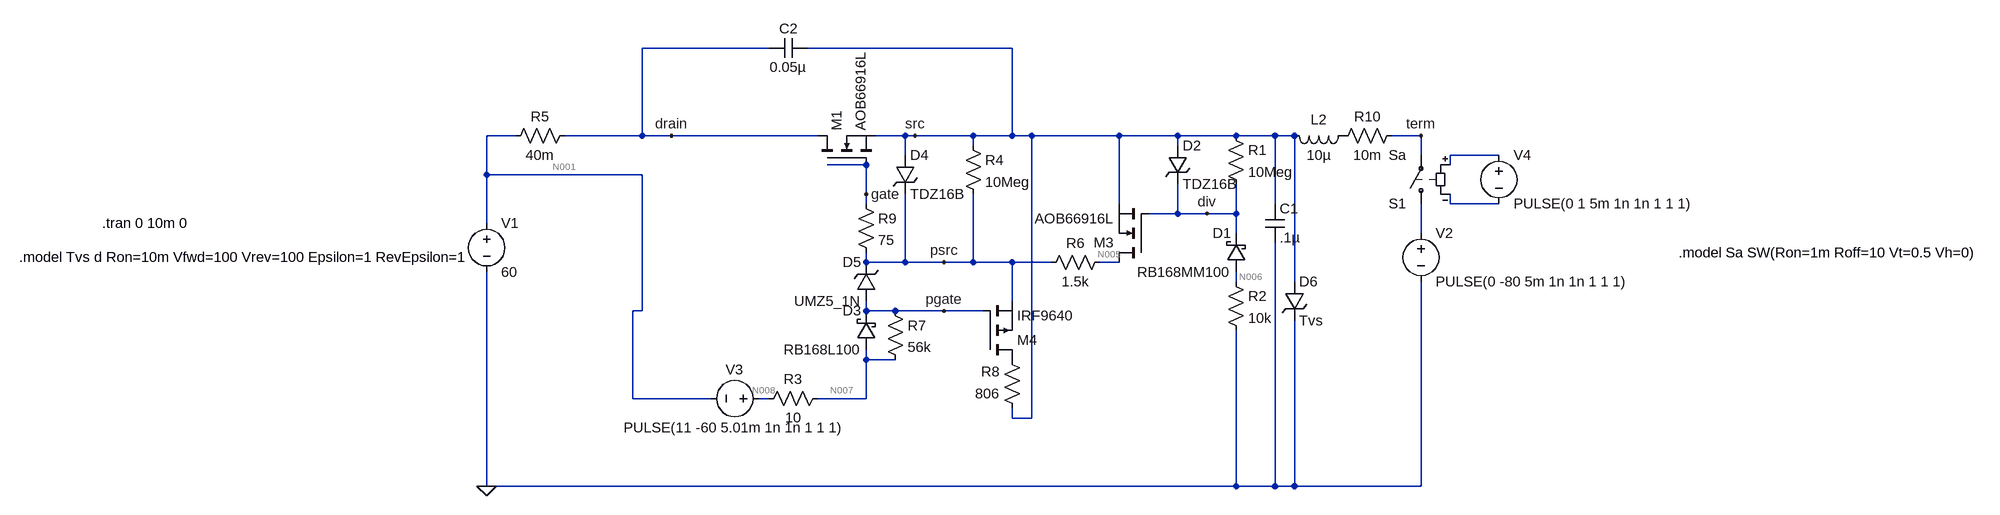
[diagram p0: schematic FET Driver rev3.asc]
FET Driver rev3.asc, the LTspice schematic file:
Version 4
SHEET 1 1884 732
WIRE 0 -112 -208 -112
WIRE 400 -112 64 -112
WIRE -416 32 -464 32
WIRE -208 32 -208 -112
WIRE -208 32 -336 32
WIRE -160 32 -208 32
WIRE 80 32 -160 32
WIRE 224 32 176 32
WIRE 240 32 224 32
WIRE 336 32 240 32
WIRE 400 32 400 -112
WIRE 400 32 336 32
WIRE 432 32 400 32
WIRE 576 32 432 32
WIRE 672 32 576 32
WIRE 768 32 672 32
WIRE 832 32 768 32
WIRE 864 32 832 32
WIRE 1072 32 1024 32
WIRE 336 48 336 32
WIRE 672 48 672 32
WIRE 224 64 224 32
WIRE 1072 64 1072 32
WIRE 1200 64 1120 64
WIRE 160 80 96 80
WIRE 1120 80 1120 64
WIRE -464 96 -464 32
WIRE -208 96 -464 96
WIRE 160 128 160 80
WIRE 160 144 160 128
WIRE 576 144 576 32
WIRE 832 144 832 32
WIRE 1120 144 1120 128
WIRE 1200 144 1120 144
WIRE 672 160 672 112
WIRE 672 160 624 160
WIRE 720 160 672 160
WIRE 768 160 768 112
WIRE 768 160 720 160
WIRE -464 176 -464 96
WIRE 768 192 768 160
WIRE 1072 192 1072 144
WIRE 160 240 160 224
WIRE 224 240 224 128
WIRE 224 240 160 240
WIRE 288 240 224 240
WIRE 336 240 336 128
WIRE 336 240 288 240
WIRE 400 240 336 240
WIRE 464 240 400 240
WIRE 576 240 544 240
WIRE 768 272 768 256
WIRE 864 272 864 32
WIRE 400 304 400 240
WIRE -208 320 -208 96
WIRE -208 320 -224 320
WIRE 160 320 160 304
WIRE 208 320 160 320
WIRE 288 320 208 320
WIRE 352 320 288 320
WIRE 160 400 160 384
WIRE 208 400 160 400
WIRE -224 464 -224 320
WIRE -96 464 -224 464
WIRE 0 464 -16 464
WIRE 160 464 160 400
WIRE 160 464 80 464
WIRE 400 496 400 480
WIRE 432 496 432 32
WIRE 432 496 400 496
WIRE -464 608 -464 256
WIRE 768 608 768 352
WIRE 768 608 -464 608
WIRE 832 608 832 208
WIRE 832 608 768 608
WIRE 864 608 864 336
WIRE 864 608 832 608
WIRE 1072 608 1072 272
WIRE 1072 608 864 608
FLAG 720 160 div
FLAG 240 32 src
FLAG 160 128 gate
FLAG 1072 32 term
FLAG -464 608 0
FLAG 288 320 pgate
FLAG 288 240 psrc
FLAG -160 32 drain
SYMBOL nmos 80 80 R270
SYMATTR InstName M1
SYMATTR Value AOB66916L
SYMBOL voltage -464 160 R0
WINDOW 123 0 0 Left 0
WINDOW 39 0 0 Left 0
SYMATTR InstName V1
SYMATTR Value 60
SYMBOL voltage 1072 176 R0
WINDOW 123 0 0 Left 0
WINDOW 39 0 0 Left 0
SYMATTR InstName V2
SYMATTR Value PULSE(0 -80 5m 1n 1n 1 1 1)
SYMBOL res 752 16 R0
SYMATTR InstName R1
SYMATTR Value 10Meg
SYMBOL schottky 784 256 R180
WINDOW 0 24 64 Left 2
WINDOW 3 24 0 Left 2
SYMATTR InstName D1
SYMATTR Value RB168MM100
SYMATTR Description Diode
SYMATTR Type diode
SYMBOL res 752 256 R0
SYMATTR InstName R2
SYMATTR Value 10k
SYMBOL zener 656 48 R0
SYMATTR InstName D2
SYMATTR Value TDZ16B
SYMATTR Description Diode
SYMATTR Type diode
SYMBOL sw 1072 160 R180
SYMATTR InstName S1
SYMATTR Value Sa
SYMBOL voltage 1200 48 R0
WINDOW 123 0 0 Left 0
WINDOW 39 0 0 Left 0
SYMATTR InstName V4
SYMATTR Value PULSE(0 1 5m 1n 1n 1 1 1)
SYMBOL nmos 624 240 R180
SYMATTR InstName M3
SYMATTR Value AOB66916L
SYMBOL zener 208 64 R0
SYMATTR InstName D4
SYMATTR Value TDZ16B
SYMATTR Description Diode
SYMATTR Type diode
SYMBOL ind 960 16 R90
WINDOW 0 5 56 VBottom 2
WINDOW 3 32 56 VTop 2
SYMATTR InstName L2
SYMATTR Value 10µ
SYMBOL voltage 0 464 R90
WINDOW 0 -32 56 VBottom 2
WINDOW 3 32 56 VTop 2
WINDOW 123 0 0 Left 0
WINDOW 39 0 0 Left 0
SYMATTR InstName V3
SYMATTR Value PULSE(11 -60 5.01m 1n 1n 1 1 1)
SYMBOL res -320 16 R90
WINDOW 0 0 56 VBottom 2
WINDOW 3 32 56 VTop 2
SYMATTR InstName R5
SYMATTR Value 40m
SYMBOL res 560 224 R90
WINDOW 0 0 56 VBottom 2
WINDOW 3 32 56 VTop 2
SYMATTR InstName R6
SYMATTR Value 1.5k
SYMBOL res 320 32 R0
SYMATTR InstName R4
SYMATTR Value 10Meg
SYMBOL schottky 176 384 R180
WINDOW 0 24 64 Left 2
WINDOW 3 24 0 Left 2
SYMATTR InstName D3
SYMATTR Value RB168L100
SYMATTR Description Diode
SYMATTR Type diode
SYMBOL res 96 448 R90
WINDOW 0 0 56 VBottom 2
WINDOW 3 32 56 VTop 2
SYMATTR InstName R3
SYMATTR Value 10
SYMBOL zener 176 304 R180
WINDOW 0 24 64 Left 2
WINDOW 3 24 0 Left 2
SYMATTR InstName D5
SYMATTR Value UMZ5_1N
SYMATTR Description Diode
SYMATTR Type diode
SYMBOL pmos 352 400 M180
SYMATTR InstName M4
SYMATTR Value IRF9640
SYMBOL res 192 304 R0
SYMATTR InstName R7
SYMATTR Value 56k
SYMBOL res 416 496 R180
WINDOW 0 36 76 Left 2
WINDOW 3 36 40 Left 2
SYMATTR InstName R8
SYMATTR Value 806
SYMBOL TVSdiode 848 272 R0
SYMATTR InstName D6
SYMATTR Value Tvs
SYMBOL cap 816 144 R0
SYMATTR InstName C1
SYMATTR Value .1µ
SYMBOL cap 64 -128 R90
WINDOW 0 0 32 VBottom 2
WINDOW 3 32 32 VTop 2
SYMATTR InstName C2
SYMATTR Value 0.05µ
SYMBOL res 144 128 R0
SYMATTR InstName R9
SYMATTR Value 75
SYMBOL res 1040 16 R90
WINDOW 0 0 56 VBottom 2
WINDOW 3 32 56 VTop 2
SYMATTR InstName R10
SYMATTR Value 10m
TEXT -1096 176 Left 2 !.tran 0 10m 0
TEXT 1496 224 Left 2 !.model Sa SW(Ron=1m Roff=10 Vt=0.5 Vh=0)
TEXT -1232 232 Left 2 !.model Tvs d Ron=10m Vfwd=100 Vrev=100 Epsilon=1 RevEpsilon=1

The netlist it stands for:
* FET Driver rev3.asc
M1 drain gate src src AOB66916L
V1 N001 0 60
V2 N004 0 PULSE(0 -80 5m 1n 1n 1 1 1)
R1 src div 10Meg
D1 N006 div RB168MM100
R2 N006 0 10k
D2 src div TDZ16B
S1 N004 term N002 N003 Sa
V4 N002 N003 PULSE(0 1 5m 1n 1n 1 1 1)
M3 N005 div src src AOB66916L
D4 src psrc TDZ16B
L2 P001 src 10µ
V3 N008 N001 PULSE(11 -60 5.01m 1n 1n 1 1 1)
R5 drain N001 40m
R6 N005 psrc 1.5k
R4 src psrc 10Meg
D3 N007 pgate RB168L100
R3 N007 N008 10
D5 pgate psrc UMZ5_1N
M4 P002 pgate psrc psrc IRF9640
R7 pgate N007 56k
R8 src P002 806
D6 src 0 Tvs
C1 src 0 .1µ
C2 src drain 0.05µ
R9 gate psrc 75
R10 term P001 10m
.model D D
.lib standard.dio
.model NMOS NMOS
.model PMOS PMOS
.lib standard.mos
.tran 0 10m 0
.model Sa SW(Ron=1m Roff=10 Vt=0.5 Vh=0)
.model Tvs d Ron=10m Vfwd=100 Vrev=100 Epsilon=1 RevEpsilon=1
.backanno
.end

* Results of the author's LTspice run, read from the files saved beside the schematic
* Operating Point, zero values left out:
*   V(drain) = 59.76 V
*   V(gate) = 70.43 V
*   V(src) = 59.74 V
*   V(n001) = 60 V
*   V(div) = 59.48 V
*   V(n006) = 318.9 µV
*   V(term) = 59.68 V
*   V(n005) = 70.43 V
*   V(psrc) = 70.43 V
*   V(p001) = 59.74 V
*   V(n008) = 71 V
*   V(n007) = 71 V
*   V(pgate) = 70.94 V
*   V(p002) = 59.74 V
*   Id(M4) = -48.65 pA
*   Is(M4) = 48.65 pA
*   Id(M3) = 8.791 pA
*   Is(M3) = -8.791 pA
*   Id(M1) = 5.968 A
*   Is(M1) = -5.968 A
*   I(D6) = 59.8 pA
*   I(D5) = 1.069 µA
*   I(D3) = 73.99 nA
*   I(D4) = -119.3 pA
*   I(D2) = 5.736 nA
*   I(D1) = -31.89 nA
*   I(L2) = -5.968 A
*   I(R10) = -5.968 A
*   I(R8) = -59.4 pA
*   I(R7) = -994.6 nA
*   I(R3) = -1.069 µA
*   I(R4) = -1.068 µA
*   I(R6) = -26.97 pA
*   I(R5) = -5.968 A
*   I(R2) = 31.89 nA
*   I(R1) = 26.16 nA
*   I(S1) = 5.968 A
*   I(V3) = -1.069 µA
*   I(V2) = 5.968 A
*   I(V1) = -5.968 A
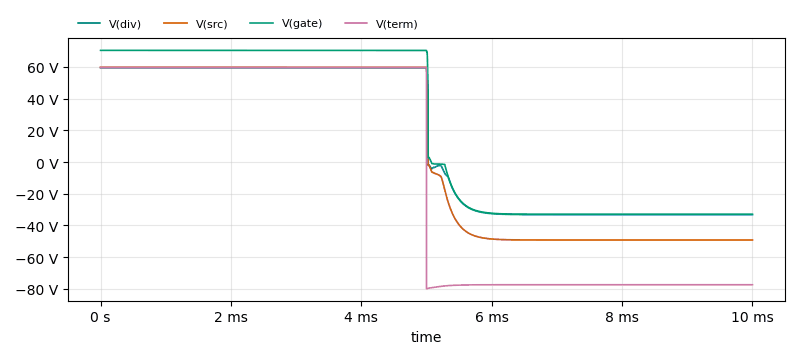
[diagram p1: Transient Analysis of FET Driver rev3.asc, plotted from the saved traces]
* Transient Analysis, 1 run:
*   V(div): min -33.22 V, max 59.48 V, average 14.67 V, rms 47.62 V, last -33.22 V
*   V(src): min -49.21 V, max 59.74 V, average 7.149 V, rms 53.74 V, last -49.21 V
*   V(gate): min -32.96 V, max 70.43 V, average 20.37 V, rms 54.53 V, last -32.96 V
*   V(term): min -79.99 V, max 59.68 V, average -8.935 V, rms 69.19 V, last -77.43 V